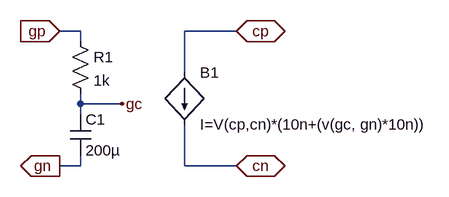
[diagram p0: schematic aime_gaz_sensor.asc]
aime_gaz_sensor.asc, the LTspice schematic file:
Version 4
SHEET 1 880 680
WIRE -176 48 -208 48
WIRE 64 48 -16 48
WIRE -176 64 -176 48
WIRE -16 112 -16 48
WIRE -176 160 -176 144
WIRE -112 160 -176 160
WIRE -176 176 -176 160
WIRE -176 256 -176 240
WIRE -176 256 -208 256
WIRE -16 256 -16 192
WIRE 64 256 -16 256
FLAG -208 48 gp
IOPIN -208 48 In
FLAG -208 256 gn
IOPIN -208 256 Out
FLAG -112 160 gc
FLAG 64 48 cp
IOPIN 64 48 BiDir
FLAG 64 256 cn
IOPIN 64 256 BiDir
SYMBOL res -192 48 R0
SYMATTR InstName R1
SYMATTR Value 1k
SYMBOL cap -192 176 R0
SYMATTR InstName C1
SYMATTR Value 200µ
SYMBOL bi -16 112 R0
SYMATTR InstName B1
SYMATTR Value I=V(cp,cn)*(10n+(v(gc, gn)*10n))

The netlist it stands for:
* aime_gaz_sensor.asc
R1 gp gc 1k
C1 gc gn 200µ
B1 cp cn I=V(cp,cn)*(10n+(v(gc, gn)*10n))
.backanno
.end